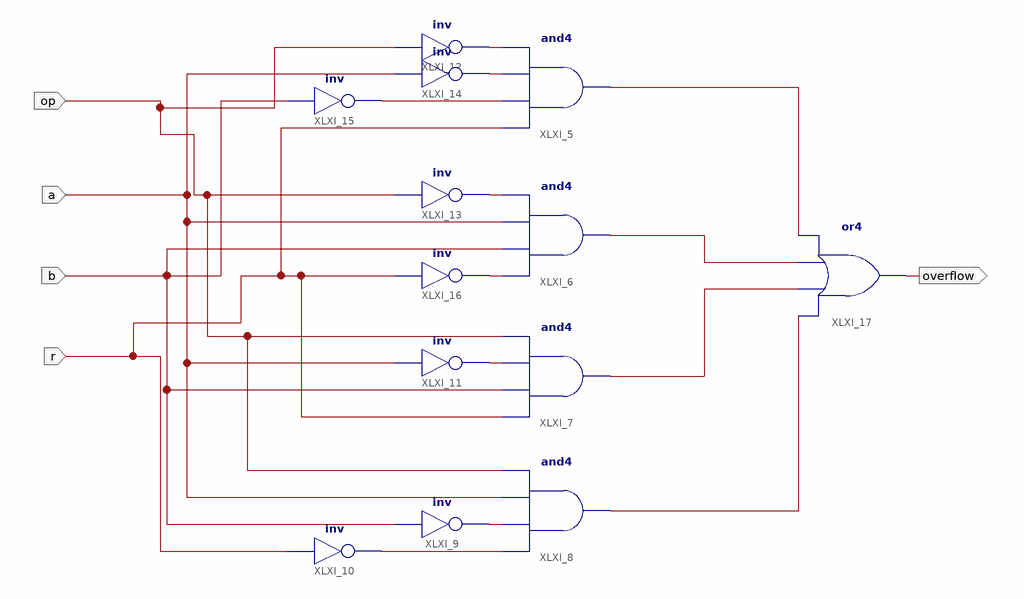
[diagram p0: schematic sheet 1]
// Xilinx ISE schematic overflow_detect.sch (spartan3e) as structural Verilog: 13 symbols, 5 ports
module overflow_detect (
  input  op,
  input  a,
  input  b,
  input  r,
  output overflow
);

  wire XLXN_5, XLXN_6, XLXN_7, XLXN_8, XLXN_9, XLXN_10, XLXN_11, XLXN_12, XLXN_24, XLXN_25, XLXN_26, XLXN_27;

  and XLXI_5 (XLXN_24, r, XLXN_11, XLXN_10, XLXN_8);
  and XLXI_6 (XLXN_25, XLXN_12, b, a, XLXN_9);
  and XLXI_7 (XLXN_26, r, b, XLXN_7, op);
  and XLXI_8 (XLXN_27, XLXN_6, XLXN_5, a, op);
  not XLXI_9 (XLXN_5, b);
  not XLXI_10 (XLXN_6, r);
  not XLXI_11 (XLXN_7, a);
  not XLXI_12 (XLXN_8, op);
  not XLXI_13 (XLXN_9, op);
  not XLXI_14 (XLXN_10, a);
  not XLXI_15 (XLXN_11, b);
  not XLXI_16 (XLXN_12, r);
  or XLXI_17 (overflow, XLXN_27, XLXN_26, XLXN_25, XLXN_24);
endmodule
